# Altium schematic sheet Nuio_LeftKeyboard_Rev_E_2_MCU.SchDoc: Nuio - Left Keyboard MCU
size B; SheetNumber: 2; SheetTotal: 5; PageSetup: Record=PageOptions|CenterHorizontal=True|CenterVertical=True|PrintScale=0.95|XCorrection=1.00|YCorrection=1.00|PrintKind=1|BorderSize=5000000|LeftOffset=0|BottomOffset=0|Orientation=2|PaperLength=1000|PaperWidth=1000|Scale=100|PaperSource=7|PrintQuality=-4|MediaType=1|DitherType=10|PaperKind=Letter|PrintScaleMode=1
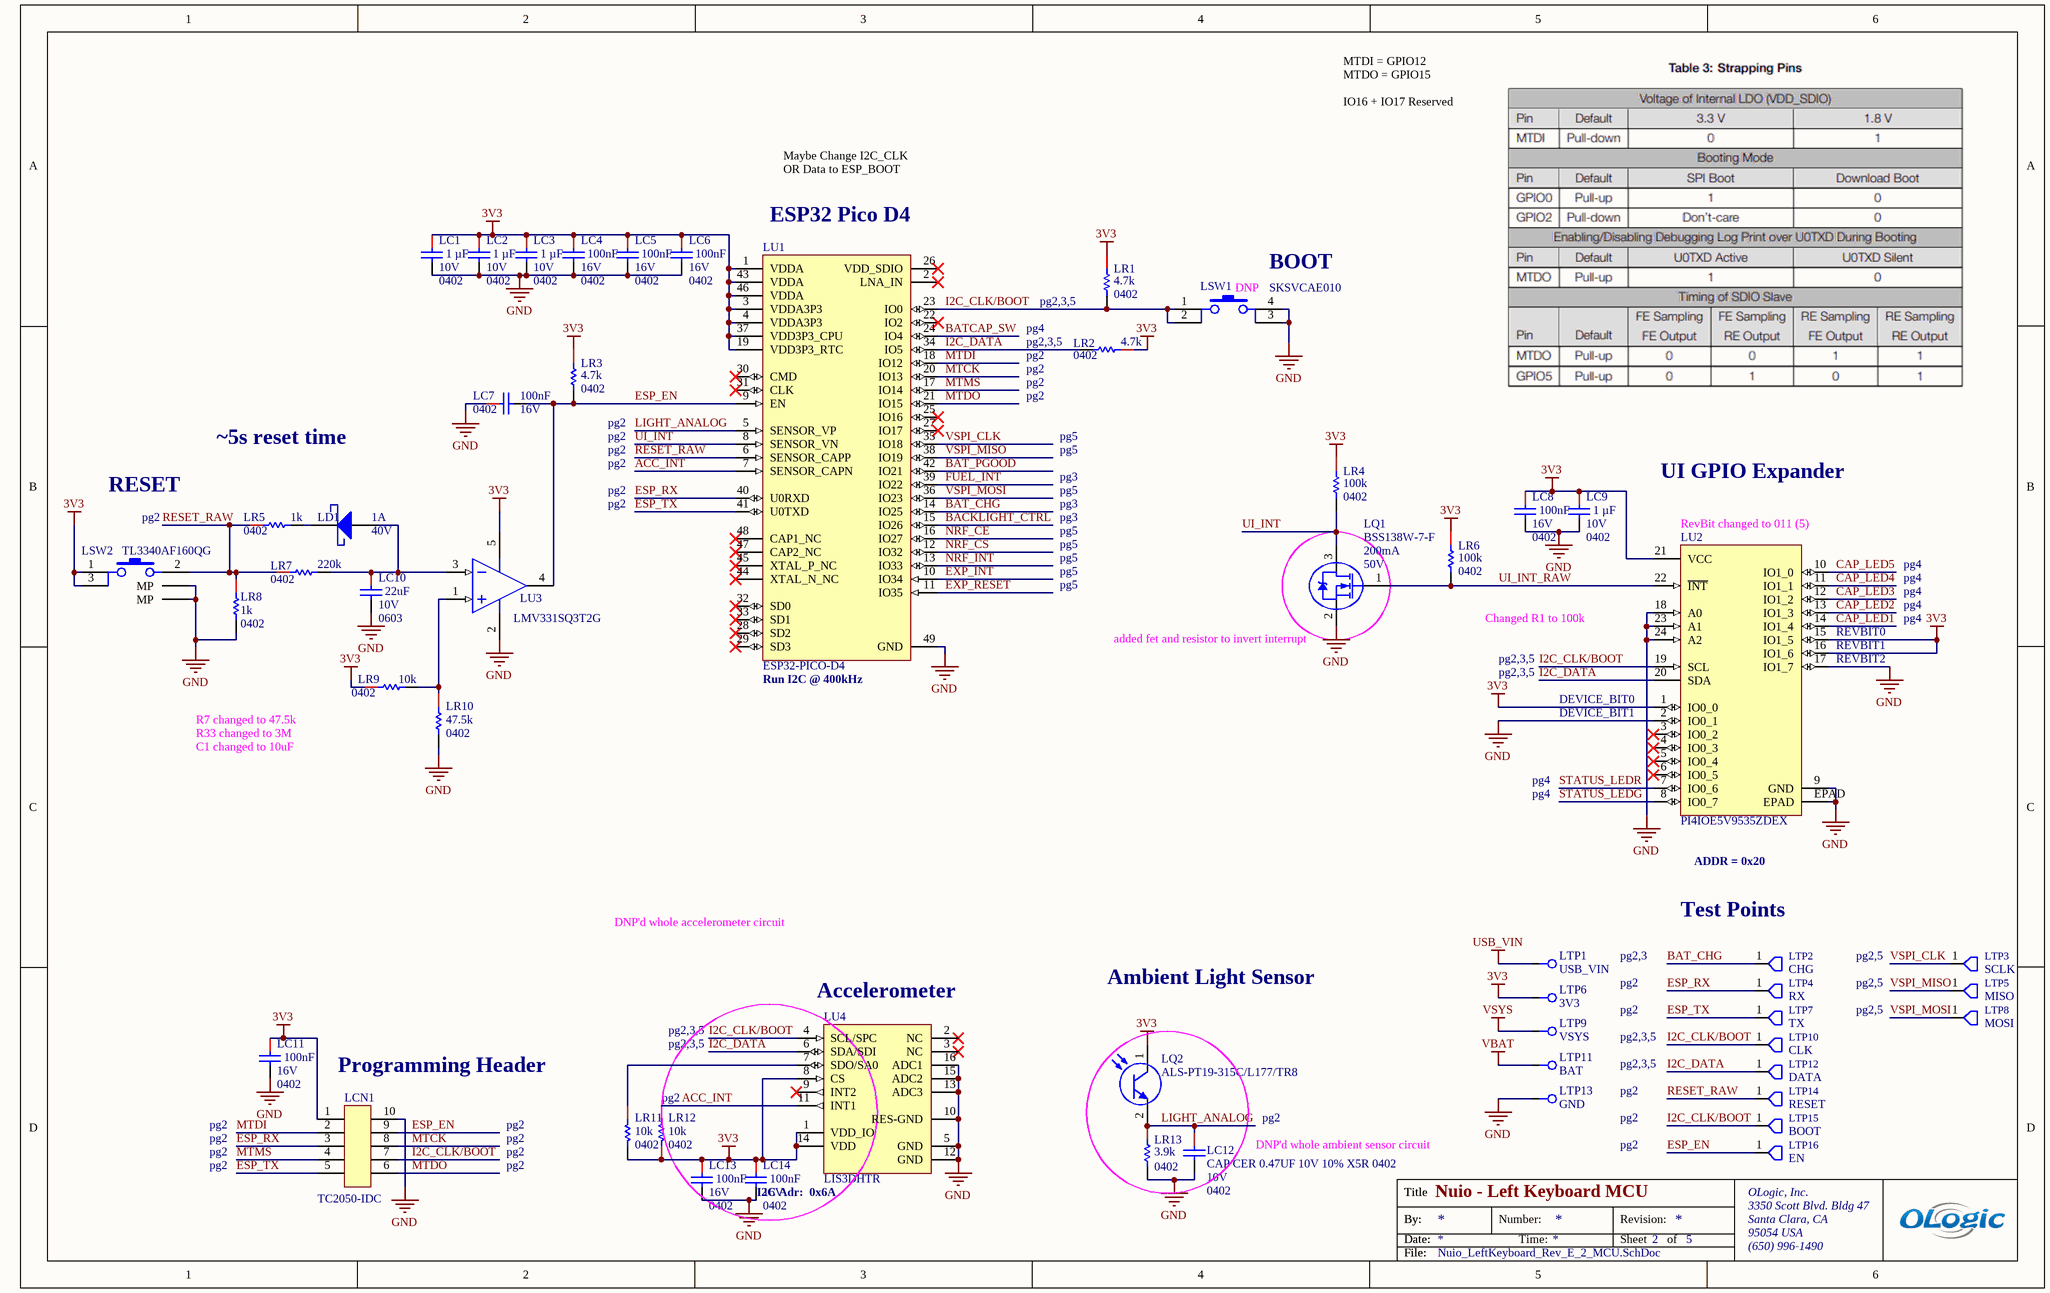
[diagram p0: Nuio_LeftKeyboard_Rev_E_2_MCU.SchDoc]

## Parts
LC1  Package (Imperial): 0402  Voltage (Rated): 10V  Capacitance: 1 µF  [CAPC0402(1005)_L]  (hidden comment: CAP CER 1UF 10V X5R 0402)
LC2  Package (Imperial): 0402  Voltage (Rated): 10V  Capacitance: 1 µF  [CAPC0402(1005)_L]  (hidden comment: CAP CER 1UF 10V X5R 0402)
LC3  Package (Imperial): 0402  Voltage (Rated): 10V  Capacitance: 1 µF  [CAPC0402(1005)_L]  (hidden comment: CAP CER 1UF 10V X5R 0402)
LC4  Package (Imperial): 0402  Voltage (Rated): 16V  Capacitance: 100nF  [CAPC0402(1005)_L]  (hidden comment: CAP CER 0.1UF 16V X5R 0402)
LC5  Package (Imperial): 0402  Voltage (Rated): 16V  Capacitance: 100nF  [CAPC0402(1005)_L]  (hidden comment: CAP CER 0.1UF 16V X5R 0402)
LC6  Package (Imperial): 0402  Voltage (Rated): 16V  Capacitance: 100nF  [CAPC0402(1005)_L]  (hidden comment: CAP CER 0.1UF 16V X5R 0402)
LC7  Package (Imperial): 0402  Voltage (Rated): 16V  Capacitance: 100nF  [CAPC0402(1005)_L]  (hidden comment: CAP CER 0.1UF 16V X5R 0402)
LC8  Package (Imperial): 0402  Voltage (Rated): 16V  Capacitance: 100nF  [CAPC0402(1005)_L]  (hidden comment: CAP CER 0.1UF 16V X5R 0402)
LC9  Package (Imperial): 0402  Voltage (Rated): 10V  Capacitance: 1 µF  [CAPC0402(1005)_L]  (hidden comment: CAP CER 1UF 10V X5R 0402)
LC10  22uF  Voltage Rating (DC): 10V  Case Code (Imperial): 0603  [CAPC0603(1608)_L]
LC11  Package (Imperial): 0402  Voltage (Rated): 16V  Capacitance: 100nF  [CAPC0402(1005)_L]  (hidden comment: CAP CER 0.1UF 16V X5R 0402)
LC12  CAP CER 0.47UF 10V 10% X5R 0402  Voltage (Rated): 10V  Package (Imperial): 0402  [CAPC0402(1005)_L]  (no BOM)
LC13  Package (Imperial): 0402  Voltage (Rated): 16V  Capacitance: 100nF  [CAPC0402(1005)_L]  (hidden comment: CAP CER 0.1UF 16V X5R 0402)  (no BOM)
LC14  Package (Imperial): 0402  Voltage (Rated): 16V  Capacitance: 100nF  [CAPC0402(1005)_L]  (hidden comment: CAP CER 0.1UF 16V X5R 0402)  (no BOM)
LCN1  TC2050-IDC  [TC2050-IDC]  (no BOM)
LD1  DC Reverse Voltage Max: 40V  Current Avg Rectified: 1A  [PMEG4010AESBYL-Footprint-1]  (hidden comment: PMEG4010AESBYL)
LQ1  BSS138W-7-F  Continuous Drain Current (ID): 200mA  Voltage Rating (DC): 50V  [DIOD-SOT323-3_V]
LQ2  ALS-PT19-315C/L177/TR8  [ALS-PT19-315C_L177_TR8]  (no BOM)
LR1  value 4.7k  Case/Package: 0402  [RESC0402(1005)_L]  (hidden comment: RES SMD 4.7K OHM 1% 1/16W 0402)
LR2  value 4.7k  Case Code (Imperial): 0402  [RESC0402(1005)_L]  (hidden comment: RES SMD 4.7K OHM 1% 1/16W 0402)
LR3  value 4.7k  Case Code (Imperial): 0402  [RESC0402(1005)_L]  (hidden comment: RES SMD 4.7K OHM 1% 1/16W 0402)
LR4  value 100k  Case Code (Imperial): 0402  [RESC0402(1005)_L]  (hidden comment: RES 100K OHM 1% 1/16W 0402)
LR5  Resistance: 1k  Package (Imperial): 0402  [RESC0402(1005)_L]  (hidden comment: RES SMD 1K OHM 1% 1/16W 0402)
LR6  value 100k  Case Code (Imperial): 0402  [RESC0402(1005)_L]  (hidden comment: RES 100K OHM 1% 1/16W 0402)
LR7  Package (Imperial): 0402  [RESC0402(1005)_L]  (hidden comment: 220K)
LR8  Resistance: 1k  Package (Imperial): 0402  [RESC0402(1005)_L]  (hidden comment: RES SMD 1K OHM 1% 1/16W 0402)
LR9  Resistance: 10k  Package (Imperial): 0402  [RESC0402_YAGEO]  (hidden comment: RES SMD 10K OHM 1% 1/16W 0402)
LR10  Resistance: 47.5k  Package (Imperial): 0402  [RESC0402(1005)_L]  (hidden comment: RES 47.5K OHM 1% 1/16W 0402)
LR11  Package (Imperial): 0402  Resistance: 10k  [RESC0402(1005)_L]  (hidden comment: RES SMD 10K OHM 1% 1/16W 0402)  (no BOM)
LR12  Package (Imperial): 0402  Resistance: 10k  [RESC0402(1005)_L]  (hidden comment: RES SMD 10K OHM 1% 1/16W 0402)  (no BOM)
LR13  Package (Imperial): 0402  [RESC0402(1005)_L]  (hidden comment: 3.9K)  (no BOM)
LSW1  SKSVCAE010  [SKSVCAE010]  (no BOM)
LSW2  TL3340AF160QG  [TL3340AF160QG]
LTP1  USB_VIN  [Pogo-Testpoint]  (no BOM)
LTP2  CHG  [MTK-TESTPOINT-20]  (no BOM)
LTP3  SCLK  [MTK-TESTPOINT-20]  (no BOM)
LTP4  RX  [MTK-TESTPOINT-20]  (no BOM)
LTP5  MISO  [MTK-TESTPOINT-20]  (no BOM)
LTP6  3V3  [Pogo-Testpoint]  (no BOM)
LTP7  TX  [MTK-TESTPOINT-20]  (no BOM)
LTP8  MOSI  [MTK-TESTPOINT-20]  (no BOM)
LTP9  VSYS  [Pogo-Testpoint]  (no BOM)
LTP10  CLK  [MTK-TESTPOINT-20]  (no BOM)
LTP11  BAT  [Pogo-Testpoint]  (no BOM)
LTP12  DATA  [MTK-TESTPOINT-20]  (no BOM)
LTP13  GND  [Pogo-Testpoint]  (no BOM)
LTP14  RESET  [MTK-TESTPOINT-20]  (no BOM)
LTP15  BOOT  [MTK-TESTPOINT-20]  (no BOM)
LTP16  EN  [MTK-TESTPOINT-20]  (no BOM)
LU1  ESP32-PICO-D4  [ESP32-PICO-D4]
LU2  PI4IOE5V9535ZDEX  [PI4IOE5V9535ZDEX]
LU3  LMV331SQ3T2G  [ONSC-SC70-5-419A-02_K_L]
LU4  LIS3DHTR  [LGA16]  (no BOM)

## Nets
3V3: LC1.1 LC2.1 LC3.1 LC4.1 LC5.1 LC6.1 LC8.1 LC9.1 LC11.1 LC13.1 LC14.1 LCN1.1 LQ2.1(C) LR1.1 LR2.1 LR3.1 LR4.1 LR6.1 LR9.1 LR11.2 LR12.1 LSW2.1 LSW2.3 LTP6.1 LU1.1(VDDA) LU1.3(VDDA3P3) LU1.4(VDDA3P3) LU1.19(VDD3P3_RTC) LU1.37(VDD3P3_CPU) LU1.43(VDDA) LU1.46(VDDA) LU2.1(IO0_0) LU2.15(IO1_5) LU2.16(IO1_6) LU2.21(VCC) LU3.5(VCC) LU4.1(VDD_IO) LU4.8(CS) LU4.14(VDD)
GND: LC1.2 LC2.2 LC3.2 LC4.2 LC5.2 LC6.2 LC7.1 LC8.2 LC9.2 LC10.2 LC11.2 LC12.2 LC13.2 LC14.2 LCN1.10 LQ1.2(S) LR8.2 LR10.2 LR13.2 LSW1.3 LSW1.4 LSW2.MP1(MP) LSW2.MP2(MP) LTP13.1 LU1.49(GND) LU2.2(IO0_1) LU2.9(GND) LU2.17(IO1_7) LU2.18(A0) LU2.23(A1) LU2.24(A2) LU2.EPAD LU3.2(GND) LU4.5(GND) LU4.10(RES-GND) LU4.12(GND) LU4.13(ADC3) LU4.15(ADC2) LU4.16(ADC1)
USB_VIN: LTP1.1
VBAT: LTP11.1
VSYS: LTP9.1
ACC_INT: LR12.2 LU1.7(SENSOR_CAPN) LU4.11(INT1)
BACKLIGHT_CTRL: LU1.15(IO26)
BAT_CHG: LTP2.1(TP) LU1.14(IO25)
BAT_PGOOD: LU1.42(IO21)
BATCAP_SW: LU1.24(IO4)
CAP_LED1: LU2.14(IO1_4)
CAP_LED2: LU2.13(IO1_3)
CAP_LED3: LU2.12(IO1_2)
CAP_LED4: LU2.11(IO1_1)
CAP_LED5: LU2.10(IO1_0)
ESP_EN: LC7.2 LCN1.9 LR3.2 LTP16.1(TP) LU1.9(EN) LU3.4(OUT)
ESP_RX: LCN1.3 LTP4.1(TP) LU1.40(U0RXD)
ESP_TX: LCN1.5 LTP7.1(TP) LU1.41(U0TXD)
EXP_INT: LU1.10(IO34)
EXP_RESET: LU1.11(IO35)
FUEL_INT: LU1.39(IO22)
I2C_CLK/BOOT: LCN1.7 LR1.2 LSW1.1 LSW1.2 LTP10.1(TP) LTP15.1(TP) LU1.23(IO0) LU2.19(SCL) LU4.4(SCL/SPC)
I2C_DATA: LR2.2 LTP12.1(TP) LU1.34(IO5) LU2.20(SDA) LU4.6(SDA/SDI)
LIGHT_ANALOG: LC12.1 LQ2.2(E) LR13.1 LU1.5(SENSOR_VP)
MTCK: LCN1.8 LU1.20(IO13)
MTDI: LCN1.2 LU1.18(IO12)
MTDO: LCN1.6 LU1.21(IO15)
MTMS: LCN1.4 LU1.17(IO14)
NRF_CE: LU1.16(IO27)
NRF_CS: LU1.12(IO32)
NRF_INT: LU1.13(IO33)
RESET_RAW: LR5.1 LR7.1 LR8.1 LSW2.2 LTP14.1(TP) LU1.6(SENSOR_CAPP)
STATUS_LEDG: LU2.8(IO0_7)
STATUS_LEDR: LU2.7(IO0_6)
UI_INT: LQ1.3(D) LR4.2 LU1.8(SENSOR_VN)
UI_INT_RAW: LQ1.1(G) LR6.2 LU2.22(~{INT})
VSPI_CLK: LTP3.1(TP) LU1.35(IO18)
VSPI_MISO: LTP5.1(TP) LU1.38(IO19)
VSPI_MOSI: LTP8.1(TP) LU1.36(IO23)
NetLC10_1: LC10.1 LD1.2(A) LR7.2 LU3.3(IN-)
NetLD1_1: LD1.1(K) LR5.2
NetLR9_2: LR9.2 LR10.1 LU3.1(IN+)
NetLR11_1: LR11.1 LU4.7(SDO/SA0)

Not connected (* = marked no-connect by the designer): LU1 2(LNA_IN)* 22(IO2)* 25(IO16)* 26(VDD_SDIO)* 27(IO17)* 28(SD2)* 29(SD3)* 30(CMD)* 31(CLK)* 32(SD0)* 33(SD1)* 44(XTAL_N_NC)* 45(XTAL_P_NC)* 47(CAP2_NC)* 48(CAP1_NC)*; LU2 3(IO0_2)* 4(IO0_3)* 5(IO0_4)* 6(IO0_5)*; LU4 2(NC)* 3(NC)* 9(INT2)*

## Notes on the sheet
- MTDI = GPIO12
  MTDO = GPIO15
  IO16 + IO17 Reserved
- (near LU1) ESP32 Pico D4
- Maybe Change I2C_CLK OR Data to ESP_BOOT
- (near LSW1) DNP
- (near LSW1) BOOT
- pg4
- (near LR2) pg2
- (near LR2) pg2,3,5
- (near LR1) pg2,3,5
- (near LR3) pg2
- pg2
- RESET
- ~5s reset time
- pg3
- pg5
- UI GPIO Expander
- (near LSW2) pg2
- (near LU2) RevBit changed to 011 (5)
- (near LQ1) added fet and resistor to invert interrupt
- (near LR6) Changed R1 to 100k
- (near LU2) REVBIT0
- (near LU1) Run I2C @ 400kHz
- pg2,3,5
- DEVICE_BIT0
- (near LU2) REVBIT1
- (near LU2) REVBIT2
- R33 changed to 3M
- C1 changed to 10uF
- R7 changed to 47.5k
- DEVICE_BIT1
- ADDR = 0x20
- DNP'd whole accelerometer circuit
- pg2,3
- (near LTP2) Test Points
- pg2,5
- (near LU4) Accelerometer
- Ambient Light Sensor
- (near LCN1) Programming Header
- (near LR12) pg2
- DNP'd whole ambient sensor circuit
- (near LU4) I2C Adr:  0x6A
- Title
- By:
- Date:
- Number:
- Time:
- Revision:
- Sheet
- of
- OLogic, Inc.
- 3350 Scott Blvd. Bldg 47
- Santa Clara, CA
- 95054 USA
- File:
- (650) 996-1490

## Library data of the parts
LC1-LC3 LC9 = CMP-001-1453-04: ±20% 10V Ceramic Capacitor X5R 0402 (1005 Metric); Manufacturer Part Number: CC0402MRX5R6BB105; Manufacturer: Yageo; Supplier: Digi-Key; Tolerance: ±20%; Supplier Part Number: 311-1732-1-ND; Temperature Coefficient: X5R; Height: 0.55mm
LC4-LC8 LC11 LC13 LC14 = CMP-001-0605-23: ±10% 16V Ceramic Capacitor X5R 0402 (1005 Metric); Manufacturer: Taiyo Yuden; Manufacturer Part Number: EMK105BJ104KV-F; Package (Metric): 1005; Temperature (Max): 85°C; Temperature (Min): -55°C; Height: 550µm; Supplier: Digi-Key; Supplier Part Number: 587-1226-1-ND; Tolerance: 10%; Dielectric Material: Ceramic; Temperature Coefficient: X5R; Width: 500µm; Length: 1mm; Mounting Type: SMD
LC10 = CMP-001-0737-03: CAP CER 22UF 10V 20% 0603; Dielectric: X5R; Max Operating Temperature: 85°C; Termination: SMD/SMT; Case Code (Metric): 1608; Width: 0.8mm; Length: 1.6mm; Packaging: Tape and Reel; Capacitance: 22uF; Tolerance: 20%; Mount: Surface Mount; Weight: 0.000222oz; Package Quantity: 4000; Min Operating Temperature: -55°C; Lead Free: Lead Free; REACH SVHC: No SVHC; Thickness: 0.039inch; Depth: 0.8mm; Voltage Rating: 10V; Material: Ceramic; Height: 0.8mm; Case/Package: 0603
LC12 = CMP-007-0056-15: 0.47 µF ±10% 10V Ceramic Capacitor X7S 0402 (1005 Metric); Capacitance: 470nF; Package (Metric): 1005; Temperature (Min): -55°C; Temperature (Max): 125°C; Width: 500µm; Temperature Coefficient: X7S; Mounting Type: SMD; Height: 600µm; Length: 1mm; Dielectric Material: Ceramic; Tolerance: 10%
LCN1 = CMP-001-1753-01: Adapter Cbl Plug Of Nails 10PIN; Package Quantity: 1; Series: Plug-Of-Nails™; RoHS Compliant: Yes
LD1 = CMP-001-0106-06: DIODE SCHOTTKY 40V 1A SOD993; Voltage Forward Max: 505mV @ 1A; Diode Type: Schottky
LQ1 = CMP-00300-01: DIODES INC. - BSS138W-7-F. - BSS FAMILY SOT323 T&R 3K ROHS COMPLIANT: YES; Manufacturer: Diodes Incorporated; Power: 200mW; Number of Channels: 1; Drain to Source Breakdown Voltage: 75V; Element Configuration: Single; Turn-On Delay Time: 20ns; Gate to Source Voltage (Vgs): 20V; Threshold Voltage: 1.2V; Input Capacitance: 50pF; On-State Resistance: 3.5R; Polarity: N-CHANNEL; Drain to Source Resistance: 1.4R; Voltage: 50V; Manufacturer Part Number: BSS138W-7-F; Current Rating: 200mA; Drain to Source Voltage (Vdss): 50V; Number of Elements: 1; Lead Free: Lead Free; Min Operating Temperature: -55°C; Max Operating Temperature: 150°C; Nominal Vgs: 1.2V; Packaging: Tape and Reel; Drain-source On Resistance-Max: 3.5R; Width: 1.35mm; Termination: SMD/SMT; Rds On Max: 3.5R; Height: 1mm; REACH SVHC: No SVHC; Package Quantity: 3000; Case/Package: SOT-323; Contact Plating: Tin,Matte; RoHS Compliant: Yes; Length: 2.2mm; Number of Pins: 3; Mount: Surface Mount; Weight: 0.000212oz; Turn-Off Delay Time: 20ns; Series: -; Dual Supply Voltage: 50V; Max Power Dissipation: 200mW
LQ2 = CMP-00305-02: SENSOR PHOTO 630NM 2SMD; Manufacturer: Everlight Electronics Co Ltd; Polarity: NPN; Number of Elements: 1; Rise Time: 0.11ms; Max Breakdown Voltage: 5.5V; Lens Style: Flat; Fall Time: 0.22ms; Dark Current: 100nA; Radiation Hardening: No; Packaging: Tape and Reel; Max Operating Temperature: 85°C; Manufacturer Product Number: ALS-PT19-315C/L177/TR8; RoHS Compliant: Yes; Case/Package: SMD/SMT; Mount: Surface Mount; Wavelength: 630nm; Min Operating Temperature: -40°C; Package Quantity: 1; Number of Pins: 2; Collector Emitter Breakdown Voltage: 5.5V
LR1-LR3 = CMP-001-0724-07: 4.7 kOhms ±1% 0.063W, 1/16W Chip Resistor 0402 (1005 Metric) Moisture Resistant Thick Film; Manufacturer: YAGEO; Manufacturer Part Number: RC0402FR-074K7L; Max Power Dissipation: 63mW; Power Rating: 62.5mW; Temperature Coefficient: 100ppm/°C; Voltage Rating: 50V; Min Operating Temperature: -55°C; Termination: SMD/SMT; Max Operating Temperature: 155°C; Width: 0.5mm; Length: 1mm; Tolerance: 1%; Construction: Rectangular; Depth: 0.5mm; Features: Moisture Resistant; Lead Free: Lead Free; Military Standard: Not; Reach SVHC Compliant: No; Resistance Tolerance: 1%; Resistor Type: Thick Film; RoHS Compliant: Yes; Series: RC; Voltage Rating (DC): 50V
  LR1: Case Code (Imperial): 0402
  LR2 LR3: Case/Package: 0402
LR4 LR6 = CMP-007-0354-15: ±1% 0.063W, 1/16W Chip Resistor 0402 (1005 Metric) Moisture Resistant Thick Film; Manufacturer: YAGEO; Manufacturer Part Number: RC0402FR-07100KL; Max Power Dissipation: 63mW; Temperature Coefficient: 100ppm/°C; Voltage Rating: 50V; Case/Package: 0402; Construction: Rectangular; Depth: 0.5mm; Features: Moisture Resistant; Height: 0.016inch; Lead Free: Lead Free; Length: 0.039inch; Max Operating Temperature: 155°C; Military Standard: Not; Min Operating Temperature: -55°C; Power Rating: 63mW; Reach SVHC Compliant: No; Resistance Tolerance: 1%; Resistor Type: Thick Film; RoHS Compliant: Yes; Series: RC; Termination: SMD/SMT; Tolerance: 1%; Width: 0.02inch
LR5 LR8 = CMP-007-0405-16: 1k ±1% 0.063W, 1/16W Chip Resistor 0402 (1005 Metric) Moisture Resistant Thick FilmRES 1K OHM 1% 1/16W 0402; Manufacturer: Yageo; Manufacturer Part Number: RC0402FR-071KL; Power: 63mW; Package (Metric): 1005; Temperature Coefficient: 100ppm/°C; Supplier Part Number: 311-1.00KLRCT-ND; Supplier: Digi-Key; Height: 400µm; Termination: SMD/SMT; Composition: Thick Film; Width: 500µm; Tolerance: 1%
LR7 = CMP-00007-24: RES SMD 220K OHM 1% 1/10W 0402; Package (Metric): 1005; Max Power Dissipation: 100mW; Temperature Coefficient: 100ppm/°C; Voltage Rating: 50V; Power: 63mW; Lead Free: Lead Free; Termination: SMD/SMT; Resistance: 220k; Min Operating Temperature: -55°C; Features: Automotive AEC-Q200; Contact Plating: Tin; Width: 500µm; Package Quantity: 1; Mount: Surface Mount; Max Operating Temperature: 155°C; Tolerance: 1%; Composition: Thick Film; Power Rating: 100mW; Weight: 2.8E-05oz; REACH SVHC: No SVHC; Depth: 0.5mm; Radiation Hardening: No; Packaging: Tape and Reel; Voltage Rating (DC): 50V; Length: 1mm; Number of Terminations: 2; Height: 350µm; Military Standard: Not
LR9 = CMP-001-1262-04: 10 kOhms ±1% 0.063W, 1/16W Chip Resistor 0402 (1005 Metric) Anti-Sulfur, Automotive AEC-Q200, Moisture Resistant Thin Film; Manufacturer: Yageo; Manufacturer Part Number: AT0402FRE0710KL; Max Power Dissipation: 63mW; Temperature Coefficient: 50ppm/°C; Width: 0.02inch; Case Code (Metric): 1005; Height: 0.014inch; Min Operating Temperature: -55°C; Supplier: Digi-Key; Tolerance: 1%; Features: Moisture Resistant,Automotive AEC-Q200,Anti-Sulfur; Length: 0.039inch; Number of Terminations: 2; Case/Package: 0402; Packaging: Tape and Reel; Composition: Thin Film; Supplier Part Number: YAG2104CT-ND; Max Operating Temperature: 155°C
LR10 = CMP-001-1735-03: 47.5 kOhms ±1% 0.063W, 1/16W Chip Resistor 0402 (1005 Metric) Moisture Resistant Thick Film; Manufacturer: Panasonic Electronic Components; Manufacturer Part Number: ERA-2ARB6041X; Temperature Coefficient: 100ppm/°C; Max Power Dissipation: 63mW; Power Rating: 62.5mW; Voltage Rating: 50V; Case Code (Metric): 1005; Min Operating Temperature: -55°C; Resistance Tolerance: 1%; Width: 0.02inch; REACH SVHC: No SVHC; Case/Package: 0402; Size Code: 0402; Depth: 0.5mm; Series: RC; Number of Terminations: 2; Packaging: Tape and Reel; Termination: SMD/SMT; Case Code (Imperial): 0402; Resistor Type: Thick Film; Tolerance: 1%; Height: 0.016inch; Construction: Rectangular; Lead Free: Lead Free; Features: Moisture Resistant; Length: 1mm; Military Standard: Not; Voltage Rating (DC): 50V; Max Operating Temperature: 155°C; RoHS Compliant: Yes; Composition: Thin Film
LR11 LR12 = CMP-007-0358-16: 10 kOhms ±1% 0.063W, 1/16W Chip Resistor 0402 (1005 Metric) Thin Film; Package (Metric): 1005; Power: 63mW; Length: 1mm; Max Operating Temperature: 155°C; Termination: SMD/SMT; Width: 500µm; Min Operating Temperature: -55°C; Tolerance: 1%; Height: 400µm
LR13 = CMP-007-0458-14: RES 3.9K OHM 1% 1/16W 0402; Power: 63mW; Temperature Coefficient: ±100ppm/°C; Package (Metric): 1005; Operating Temperature: -55°C ~ 155°C; Termination: SMD/SMT; Height: 400µm; Resistance: 3.9k; Tolerance: 1%; Length: 1mm
LSW1 = CMP-00343-02: 2.8x1.9mm Compact Type with Projection Surface Mount SKSV Series Tact Switch; Manufacturer: Alps Alpine; Voltage Rating (DC): 12 VDC; Current Rating: 50 mA; Manufacturer Part Number: SKSVCAE010; RoHS Compliant: Yes
LSW2 = CMP-00359-04: SWITCH TACTILE SPST-NO 0.05A 12V; Current Rating: 50mA; Operating Force: 160gf; Actuator Length: 0.85mm; Electrical Life: 100000Cycles; Switch Travel: 0.2mm; Switch Function: Off-Mom; Actuator Type: Standard; Actuator Material: Polyphthalamide; Max Operating Temperature: 85°C; Min Operating Temperature: -35°C; Packaging: Tape and Reel; Mechanical Life: 100000Cycles; Contact Plating: Stainless Steel,Silver; Package Quantity: 1; Series: TL3340; Contact Material: Stainless Steel,Silver; Mount: Surface Mount
LTP1 LTP6 LTP9 LTP11 LTP13 = CMP-001-0557-04: Test Point- Current one
LTP2-LTP5 LTP7 LTP8 LTP10 LTP12 LTP14-LTP16 = CMP-001-1043-02: MTK-TP20MIL
LU1 = CMP-001-1982-03: Rx Txrx Mod Wifi Surface Mount; Manufacturer: Espressif Systems; Memory Type: FLASH; Max Frequency: 40MHz; Operating Supply Voltage: 3.6V; Data Bus Width: 32b; Interface: I2C,SPI,I2S,UART; RAM Size: 520KB; Frequency: 2.5GHz; Memory Size: 4MB; Number of ADC Channels: 10; Output Power (dBm): 20dBm; Data Rate: 150Mbps; Operating Frequency: 2.4 GHz to 2.5 GHz; Sensitivity: -97dBm; Series: ESP32; Case/Package: QFN; Manufacturer Part Number: ESP32-PICO-D4; Height: 0.94mm; Package Quantity: 2000; Width: 7mm; Mount: Surface Mount; Min Operating Temperature: -40°C; Max Operating Temperature: 85°C; Length: 7mm
LU2 = CMP-001-2127-03: I/O Expander 16 I²C 400 kHz 24-TQFN (4x4); Frequency: 400kHz; Interface: I2C; Number of I/Os: 16; RoHS Compliant: Yes; Min Operating Temperature: -40°C; Mounting Technology: Surface Mount; Series: -; Packaging: Cut Tape; Max Operating Temperature: 85°C
LU3 = CMP-001-2183-02: LMV Series 5 V 1 nA SMT Single General Purpose, Low Voltage Comparator - SC-70; Manufacturer: onsemi; Natural Thermal Resistance: 280°C/W; Output Current: 84mA; Voltage Gain: 93.98dB; Number of Channels: 1; Operating Supply Voltage: 3V; Propagation Delay: 1.5us; Min Supply Voltage: 2.7V; Supply Current: 120uA; Max Input Current: 1nA; Max Supply Voltage: 5V; Input Offset Voltage (Vos): 9mV; Quiescent Current: 150uA; Radiation Hardening: No; Type: General Purpose; Lead Free: Lead Free; Case/Package: SC; Min Operating Temperature: -40°C; Reach SVHC Compliant: No; Number of Elements: 1; Width: 1.35mm; Halogen Free: Halogen Free; Technology: CMOS; Package Quantity: 3000; Series: -; Pins: 5; Max Supply Current: 120uA; Length: 2.2mm; RoHS Compliant: Yes; Packaging: Tape and Reel; Height: 1mm; Input Bias Current: 1nA; Manufacturer Part Number: LMV331SQ3T2G; Max Operating Temperature: 85°C
LU4 = CMP-010-0047-05: 3-Axis Accelerometer; Manufacturer: STMicro; MPN: LIS3DSH; Resolution: 16b; Min Supply Voltage: 1.71V; Bandwidth: 5kHz; Interface: I2C,SPI; Max Supply Voltage: 3.6V; Axis: X, Y, Z; Operating Supply Current: 11uA; Operating Supply Voltage: 2.5V; Output Type: Digital; Sensor Type: 3 Axis; Packaging: Tape and Reel; Width: 3mm; Min Supply Voltage (DC): 1.71V; Radiation Hardening: No; Max Operating Temperature: 85°C; Height: 1mm; Length: 3mm; Max Supply Voltage (DC): 3.6V; Min Operating Temperature: -40°C; RoHS Compliant: Yes; REACH SVHC: No SVHC; Contact Plating: Gold; Number of Pins: 16; Pin Count: 16; Package Quantity: 1; Case/Package: LGA; Component Name: LIS3DHTR; Series: -; Depth: 3mm; Lead Free: Lead Free